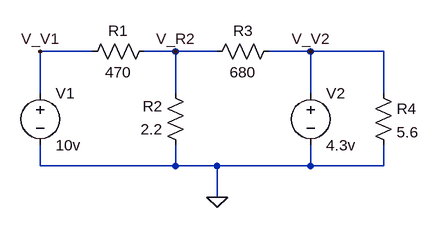
[diagram p0: schematic aula1.8.asc]
aula1.8.asc, the LTspice schematic file:
Version 4
SHEET 1 880 680
WIRE 0 96 -80 96
WIRE 128 96 80 96
WIRE 192 96 128 96
WIRE 336 96 272 96
WIRE 448 96 336 96
WIRE -80 160 -80 96
WIRE 128 160 128 96
WIRE 336 160 336 96
WIRE 448 160 448 96
WIRE -80 272 -80 240
WIRE 128 272 128 240
WIRE 128 272 -80 272
WIRE 192 272 128 272
WIRE 336 272 336 240
WIRE 336 272 192 272
WIRE 448 272 448 240
WIRE 448 272 336 272
WIRE 192 320 192 272
FLAG 192 320 0
FLAG -80 96 V_V1
FLAG 128 96 V_R2
FLAG 336 96 V_V2
SYMBOL voltage -80 144 R0
SYMATTR InstName V1
SYMATTR Value 10v
SYMBOL res 96 80 R90
WINDOW 0 0 56 VBottom 2
WINDOW 3 32 56 VTop 2
SYMATTR InstName R1
SYMATTR Value 470
SYMBOL res 144 256 R180
WINDOW 0 36 76 Left 2
WINDOW 3 36 40 Left 2
SYMATTR InstName R2
SYMATTR Value 2.2
SYMBOL res 176 112 R270
WINDOW 0 32 56 VTop 2
WINDOW 3 0 56 VBottom 2
SYMATTR InstName R3
SYMATTR Value 680
SYMBOL res 432 144 R0
SYMATTR InstName R4
SYMATTR Value 5.6
SYMBOL voltage 336 144 R0
SYMATTR InstName V2
SYMATTR Value 4.3v

The netlist it stands for:
* aula1.8.asc
V1 V_V1 0 10v
R1 V_R2 V_V1 470
R2 0 V_R2 2.2
R3 V_R2 V_V2 680
R4 V_V2 0 5.6
V2 V_V2 0 4.3v
.backanno
.end